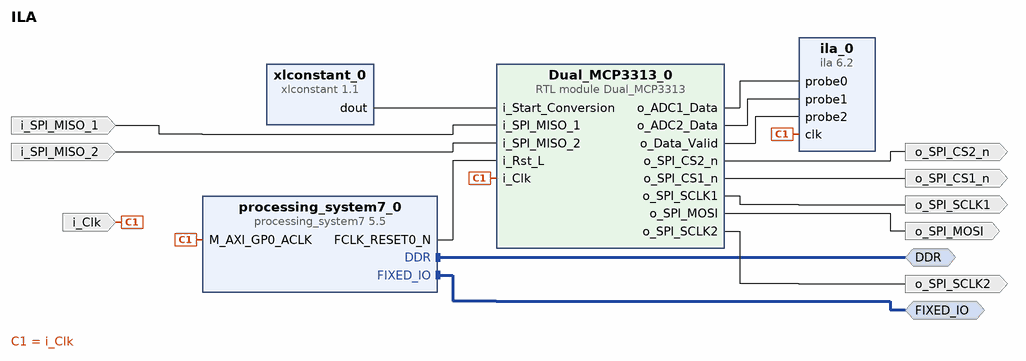
[diagram p0: block diagram of the top level]
# Vivado block design ILA, xc7z010clg400-1, Vivado 2016.4
create_bd_design ILA

create_bd_intf_port -mode Master -vlnv xilinx.com:interface:ddrx_rtl:1.0 DDR
create_bd_intf_port -mode Master -vlnv xilinx.com:display_processing_system7:fixedio_rtl:1.0 FIXED_IO
create_bd_port -dir O o_SPI_CS2_n
create_bd_port -dir O o_SPI_SCLK1
create_bd_port -dir I i_SPI_MISO_1
create_bd_port -dir I i_SPI_MISO_2
create_bd_port -dir O o_SPI_SCLK2
create_bd_port -dir O o_SPI_CS1_n
create_bd_port -dir O o_SPI_MOSI
create_bd_port -dir I -type clk i_Clk
set_property -dict {CONFIG.FREQ_HZ 50000000 CONFIG.CLK_DOMAIN ILA_processing_system7_0_0_FCLK_CLK0} [get_bd_ports i_Clk]

create_bd_cell -type ip -vlnv xilinx.com:ip:ila:6.2 ila_0
set_property -dict [list \
  CONFIG.C_PROBE2_WIDTH 1 \
  CONFIG.C_PROBE1_WIDTH 16 \
  CONFIG.C_PROBE0_WIDTH 16 \
  CONFIG.C_DATA_DEPTH 4096 \
  CONFIG.C_NUM_OF_PROBES 3 \
  CONFIG.C_EN_STRG_QUAL 1 \
  CONFIG.C_ADV_TRIGGER true \
  CONFIG.C_PROBE2_MU_CNT 2 \
  CONFIG.C_PROBE1_MU_CNT 2 \
  CONFIG.C_PROBE0_MU_CNT 2 \
  CONFIG.ALL_PROBE_SAME_MU_CNT 2 \
  CONFIG.C_ENABLE_ILA_AXI_MON false \
  CONFIG.C_MONITOR_TYPE Native \
] [get_bd_cells ila_0]
create_bd_cell -type ip -vlnv xilinx.com:ip:processing_system7:5.5 processing_system7_0
create_bd_cell -type module -reference Dual_MCP3313 Dual_MCP3313_0
create_bd_cell -type ip -vlnv xilinx.com:ip:xlconstant:1.1 xlconstant_0

# ---- connections ----

connect_bd_intf_net [get_bd_intf_ports DDR] [get_bd_intf_pins processing_system7_0/DDR]
connect_bd_intf_net [get_bd_intf_ports FIXED_IO] [get_bd_intf_pins processing_system7_0/FIXED_IO]
connect_bd_net [get_bd_pins Dual_MCP3313_0/o_ADC1_Data] [get_bd_pins ila_0/probe0]
connect_bd_net [get_bd_pins Dual_MCP3313_0/o_ADC2_Data] [get_bd_pins ila_0/probe1]
connect_bd_net [get_bd_pins Dual_MCP3313_0/o_Data_Valid] [get_bd_pins ila_0/probe2]
connect_bd_net [get_bd_pins processing_system7_0/FCLK_RESET0_N] [get_bd_pins Dual_MCP3313_0/i_Rst_L]
connect_bd_net [get_bd_pins xlconstant_0/dout] [get_bd_pins Dual_MCP3313_0/i_Start_Conversion]
connect_bd_net [get_bd_pins Dual_MCP3313_0/o_SPI_CS2_n] [get_bd_ports o_SPI_CS2_n]
connect_bd_net [get_bd_pins Dual_MCP3313_0/o_SPI_SCLK1] [get_bd_ports o_SPI_SCLK1]
connect_bd_net -net i_SPI_MISO_1_1 [get_bd_ports i_SPI_MISO_1] [get_bd_pins Dual_MCP3313_0/i_SPI_MISO_1]
connect_bd_net -net i_SPI_MISO_2_1 [get_bd_ports i_SPI_MISO_2] [get_bd_pins Dual_MCP3313_0/i_SPI_MISO_2]
connect_bd_net [get_bd_pins Dual_MCP3313_0/o_SPI_SCLK2] [get_bd_ports o_SPI_SCLK2]
connect_bd_net [get_bd_pins Dual_MCP3313_0/o_SPI_CS1_n] [get_bd_ports o_SPI_CS1_n]
connect_bd_net [get_bd_pins Dual_MCP3313_0/o_SPI_MOSI] [get_bd_ports o_SPI_MOSI]
connect_bd_net [get_bd_ports i_Clk] [get_bd_pins Dual_MCP3313_0/i_Clk] [get_bd_pins ila_0/clk] [get_bd_pins processing_system7_0/M_AXI_GP0_ACLK]

validate_bd_design
save_bd_design
